# EAGLE schematic CNC Power V2 (EAGLE 7.5.0)
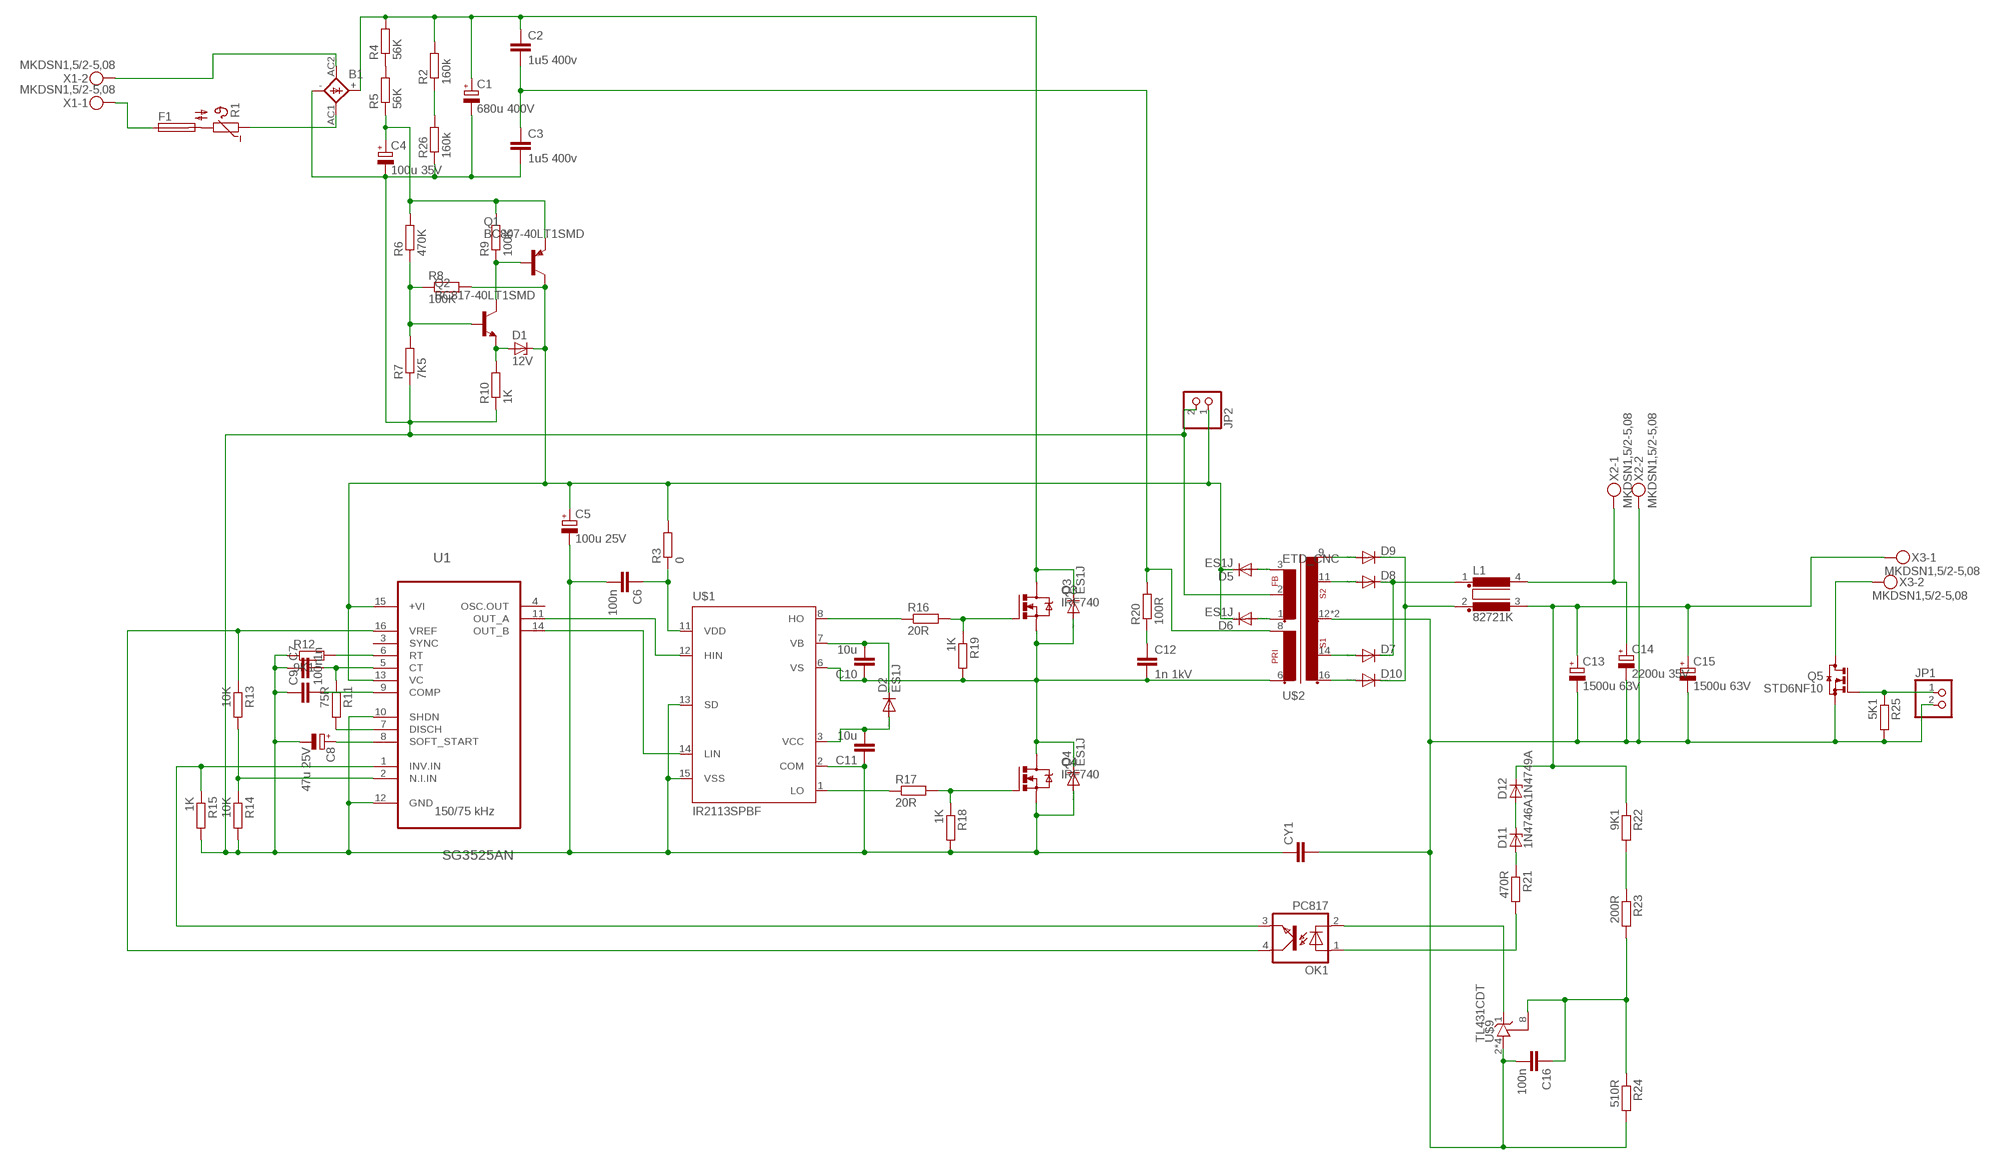
[diagram p0: schematic, sheet 1]

## Parts
B1  KBL  [KBL]
C1  680u 400V  CPOL-EUE10-35  [EB35D]
C2  1u5 400v  C-EU225-074X268  [C225-074X268]
C3  1u5 400v  C-EU225-074X268  [C225-074X268]
C4  100u 35V  CPOL-EUE2.5-7  [E2,5-7]
C5  100u 25V  CPOL-EUE2.5-7  [E2,5-7]
C6  100n  C-EUC0805  [C0805]
C7  1n  C-EUC0805  [C0805]
C8  47u 25V  CPOL-EUE2.5-7  [E2,5-7]
C9  100n  C-EUC0805  [C0805]
C10  10u  C-EUC0805  [C0805]
C11  10u  C-EUC0805  [C0805]
C12  1n 1kV  C-EU050-025X075  [C050-025X075]
C13  1500u 63V  CPOL-EUE7.5-18  [E7,5-18]
C14  2200u 35V  CPOL-EUE7.5-18  [E7,5-18]
C15  1500u 63V  CPOL-EUE7.5-18  [E7,5-18]
C16  100n  C-EUC0805  [C0805]
CY1  CYYC10B4  [YC10B4]
D1  12V  ZENER-DIODESOD80C  [SOD80C]
D2  ES1J  DIODE-DO214AC  [DO214AC]
D3  ES1J  DIODE-DO214AC  [DO214AC]
D4  ES1J  DIODE-DO214AC  [DO214AC]
D5  ES1J  DIODE-DO214AC  [DO214AC]
D6  ES1J  DIODE-DO214AC  [DO214AC]
D7  DIODE-DO220S  [DO220S]
D8  DIODE-DO220S  [DO220S]
D9  DIODE-DO220S  [DO220S]
D10  DIODE-DO220S  [DO220S]
D11  1N4746A  ZENER-DIODEDO41Z10  [DO41Z10]
D12  1N4749A  ZENER-DIODEDO41Z10  [DO41Z10]
F1  SH22,5  [SH22,5]
JP1  PINHD-1X2  [1X02]
JP2  PINHD-1X2  [1X02]
L1  82721K  [82721K]
OK1  PC817  [DIL04]
Q1  BC807-40LT1SMD  [SOT23-BEC]
Q2  BC817-40LT1SMD  [SOT23-BEC]
Q3  IRF740  [TO220BV]
Q4  IRF740  [TO220BV]
Q5  STD6NF10  [DPAK]
R1  B57164  [B57164]
R2  160k  R-EU_0207/10  [0207/10]
R3  0  R-EU_R1206  [R1206]
R4  56K  R-EU_0617/17  [0617/17]
R5  56K  R-EU_0617/17  [0617/17]
R6  470K  R-EU_R0805  [R0805]
R7  7K5  R-EU_R0805  [R0805]
R8  100K  R-EU_R0805  [R0805]
R9  100K  R-EU_R0805  [R0805]
R10  1K  R-EU_R0805  [R0805]
R11  75R  R-EU_R0805  [R0805]
R12  9K1  R-EU_R0805  [R0805]
R13  10K  R-EU_R0805  [R0805]
R14  10K  R-EU_R0805  [R0805]
R15  1K  R-EU_R0805  [R0805]
R16  20R  R-EU_R1206  [R1206]
R17  20R  R-EU_R1206  [R1206]
R18  1K  R-EU_R0805  [R0805]
R19  1K  R-EU_R0805  [R0805]
R20  100R  R-EU_0617/17  [0617/17]
R21  470R  R-EU_R0805  [R0805]
R22  9K1  R-EU_R0805  [R0805]
R23  200R  R-EU_R0805  [R0805]
R24  510R  R-EU_R0805  [R0805]
R25  5K1  R-EU_R0805  [R0805]
R26  160k  R-EU_0207/10  [0207/10]
U1  SG3525AN  [DIP254P762X510-16]
U$1  IR2113SPBF  [SO16W]
U$2  ETD_CNC  [ETD39_16PIN]
U$9  TL431CDT  [SO8]
X1  MKDSN1,5/2-5,08  [MKDSN1,5/2-5,08]
X2  MKDSN1,5/2-5,08  [MKDSN1,5/2-5,08]
X3  MKDSN1,5/2-5,08  [MKDSN1,5/2-5,08]

## Nets
12V: C5.+ D1.C D5.C D6.C JP2.1 Q1.C R3.2 R8.2 U1.13(VC) U1.15(+VI)
HV-0: B1.- C1.- C3.2 C4.- C5.- C6.2 C7.1 C8.- C9.1 C11.1 CY1.1 D4.A JP2.2 Q4.S R7.1 R10.1 R12.1 R14.2 R15.2 R18.2 R26.1 U1.10(SHDN) U1.12(GND) U$1.2(COM) U$1.13(SD) U$1.15(VSS) U$2.2(F0)
HV-150: C2.2 C3.1 R20.2 U$2.8(P-2)
HV-300: B1.+ C1.+ C2.1 D3.C Q3.D R2.2 R4.2
N$1: B1.AC2(AC1) X1.2
N$2: F1.1 X1.1
N$3: B1.AC1(AC2) R1.1
N$4: D7.A U$2.14(S1+24)
N$5: R16.1 U$1.8(HO)
N$6: R17.1 U$1.1(LO)
N$7: Q3.G R16.2 R19.1
N$8: OK1.3(EMIT) R15.1 U1.1(INV.IN)
N$9: R4.1 R5.2
N$10: C4.+ Q1.E R5.1 R6.2 R9.2
N$11: Q2.B R6.1 R7.2 R8.1
N$12: Q1.B Q2.C R9.1
N$13: C6.1 R3.1 U$1.11(VDD)
N$14: D1.A Q2.E R10.2
N$15: C7.2 R11.1 U1.5(CT)
N$16: R11.2 U1.7(DISCH)
N$17: Q4.G R17.2 R18.1
N$18: U1.11(OUT_A) U$1.12(HIN)
N$19: U1.14(OUT_B) U$1.14(LIN)
N$20: R12.2 U1.6(RT)
N$21: C8.+ U1.8(SOFT_START)
N$22: C9.2 U1.9(COMP)
N$23: OK1.4(COL) R13.1 U1.16(VREF)
N$24: R13.2 R14.1 U1.2(N.I.IN)
N$25: F1.2 R1.2
N$26: D10.A U$2.16(S1+48)
N$27: D8.A U$2.11(S-24)
N$28: D6.A U$2.1(F+12)
N$29: D5.A U$2.3(F-12)
N$30: C12.1 R20.1
N$31: D9.A U$2.9(S-48)
N$32: D7.C D8.C L1.1
N$33: D9.C D10.C L1.2
N$34: C13.- C14.- C15.- C16.2 CY1.2 JP1.2 Q5.S R24.2 R25.2 U$2.12(S-0) U$2.13(S-0) U$9.2(A) U$9.3(A) U$9.6(A) U$9.7(A) X2.2
N$35: C14.+ L1.4 X2.1
N$36: C13.+ C15.+ D12.C L1.3 R22.1 X3.1
N$37: D11.C D12.A
N$38: D11.A R21.1
N$39: OK1.1(A) R21.2
N$40: OK1.2(C) U$9.1(C)
N$41: C16.1 R23.2 R24.1 U$9.8(R)
N$42: R22.2 R23.1
N$43: JP1.1 Q5.G R25.1
N$44: R2.1 R26.2
N$45: Q5.D X3.2
VB: C10.2 D2.C U$1.7(VB)
VCC: C11.2 D2.A U$1.3(VCC)
VS: C10.1 C12.2 D3.A D4.C Q3.S Q4.D R19.2 U$1.6(VS) U$2.6(P-1)
Unconnected: U1.3(SYNC) U1.4(OSC.OUT)

## Notes on the sheet
- 150/75 kHz

## Library data of the parts
B1 = rectifier:KBL: DIOTEC RECTIFIER
C1 C4 C5 C8 C13-C15 = rcl:CPOL-EU: POLARIZED CAPACITOR, European symbol
C2 C3 C6 C7 C9-C12 C16 = rcl:C-EU: CAPACITOR, European symbol
CY1 = rcl:CY: Y CAPACITOR for power line
D1 D11 D12 = diode:ZENER-DIODE: Z-Diode
D2-D10 = diode:DIODE-: DIODE
F1 = fuse:SH22,5: FUSE HOLDER grid 22,5 mm, OGN0031 8201, Schurter (Buerklin); MF: SCHURTER; MPN: 0031.8201; OC_FARNELL: 1162740; OC_NEWARK: 96F8317
JP1 JP2 = pinhead:PINHD-1X2: PIN HEADER
L1 = _Transformers:82721K: FILTER
OK1 = optocoupler:PC817: SHARP OPTO COUPLER; MPN: PC817X4J000F; OC_FARNELL: 9707727; OC_NEWARK: 97K7059
Q1 = transistor-pnp:BC807*: PNP Transistror
Q2 = transistor-npn:BC817*: NPN Transistor
Q3 Q4 = transistor-power:IRF740: N-CHANNEL MOS FET
Q5 = Namenlos:STD6NF10
R1 = ptc-ntc:B57164: SIEMENS NTC; MPN: B57164K474K52; OC_FARNELL: 9753451; OC_NEWARK: 29M3118
R2-R26 = rcl:R-EU_: RESISTOR, European symbol
U1 = ST Microelctronics_By_element14_Batch_1:SG3525AN: REGULATING PULSE WIDTH MODULATORS; MPN: SG3525AN; OC_FARNELL: 1564368; OC_NEWARK: 89K1506; PACKAGE: PDIP-16; SUPPLIER: STMICROELECTRONICS
U$1 = Namenlos:IR2113SPBF
U$2 = _Transformers:ETD_CNC
U$9 = Namenlos:TL431
X1-X3 = con-phoenix-508:MKDSN1,5/2-5,08: MKDSN 1,5/ 2-5,08 Printklemme Nennstrom: 13,5 A Nennspannung: 250 V Rastermaß: 5,08 mm Polzahl: 2 Anschlussart: Schraubanschluss Montage: Löten Anschlussrichtung Leiter/Platine: 0 ° Artikelnummer: 1729128 Source: http://eshop.phoenixcontact.com .. 1729128.pdf